# Altium schematic sheet PX_Header.SchDoc
size A
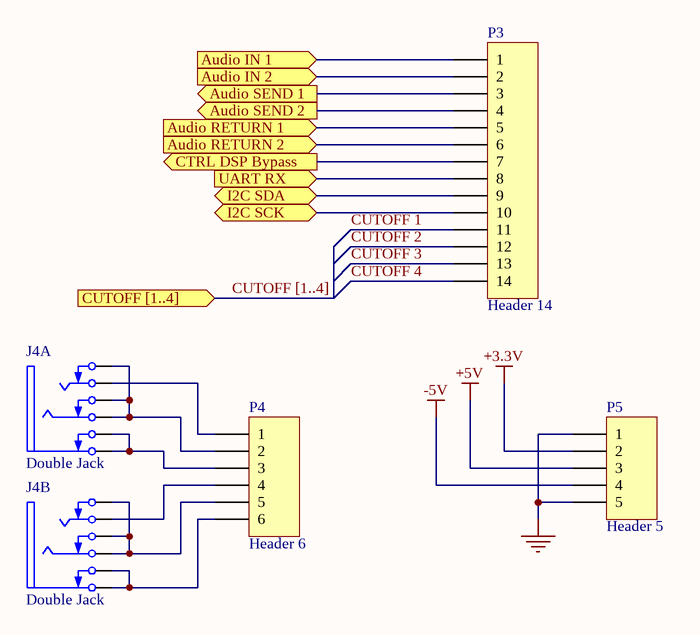
[diagram p0: PX_Header.SchDoc]

## Parts
J4  Double Jack  (parts A,B of 2)
P3  Header 14
P4  Header 6
P5  Header 5

## Ports
Audio IN 1 (in), Audio IN 2 (in), Audio RETURN 1 (in), Audio RETURN 2 (in), Audio SEND 1 (out), Audio SEND 2 (out), CTRL DSP Bypass (out), CUTOFF [1..4] (in), I2C SCK (bidir), I2C SDA (bidir), UART RX (in)

## Nets
+3.3V: P5.2
+5V: P5.3
-5V: P5.4
GND: P5.1 P5.5
Audio IN 1: P3.1 ; port Audio IN 1
Audio IN 2: P3.2 ; port Audio IN 2
Audio RETURN 1: P3.5 ; port Audio RETURN 1
Audio RETURN 2: P3.6 ; port Audio RETURN 2
Audio SEND 1: P3.3 ; port Audio SEND 1
Audio SEND 2: P3.4 ; port Audio SEND 2
CTRL DSP Bypass: P3.7 ; port CTRL DSP Bypass
CUTOFF 1: P3.11
CUTOFF 2: P3.12
CUTOFF 3: P3.13
CUTOFF 4: P3.14
I2C SCK: P3.10 ; port I2C SCK
I2C SDA: P3.9 ; port I2C SDA
UART RX: P3.8 ; port UART RX
NetJ4_1: J4.1(SB) J4.4(S) P4.6
NetJ4_2: J4.2(RB) J4.3(TB) J4.5(R) P4.5
NetJ4_6: J4.6(T) P4.4
NetJ4_7: J4.7(SB) J4.10(S) P4.3
NetJ4_8: J4.8(RB) J4.9(TB) J4.11(R) P4.2
NetJ4_12: J4.12(T) P4.1

## Buses and harness runs
bus CUTOFF [1..4] = port CUTOFF [1..4]

## Library data of the parts
J4 = Dual TRS Jack Bypassed: Dual Jack stereo bypassed
P3 = Header 14: Header, 14-Pin
P4 = Header 6: Header, 6-Pin
P5 = Header 5: Header, 5-Pin